# Altium schematic sheet carrier_card_s3.SchDoc: Debug LEDs / Anti-Aliasing / Motor Drivers
size A4; DrawnBy: Thomas Christensen; Revision: 2; SheetNumber: 3; SheetTotal: 3
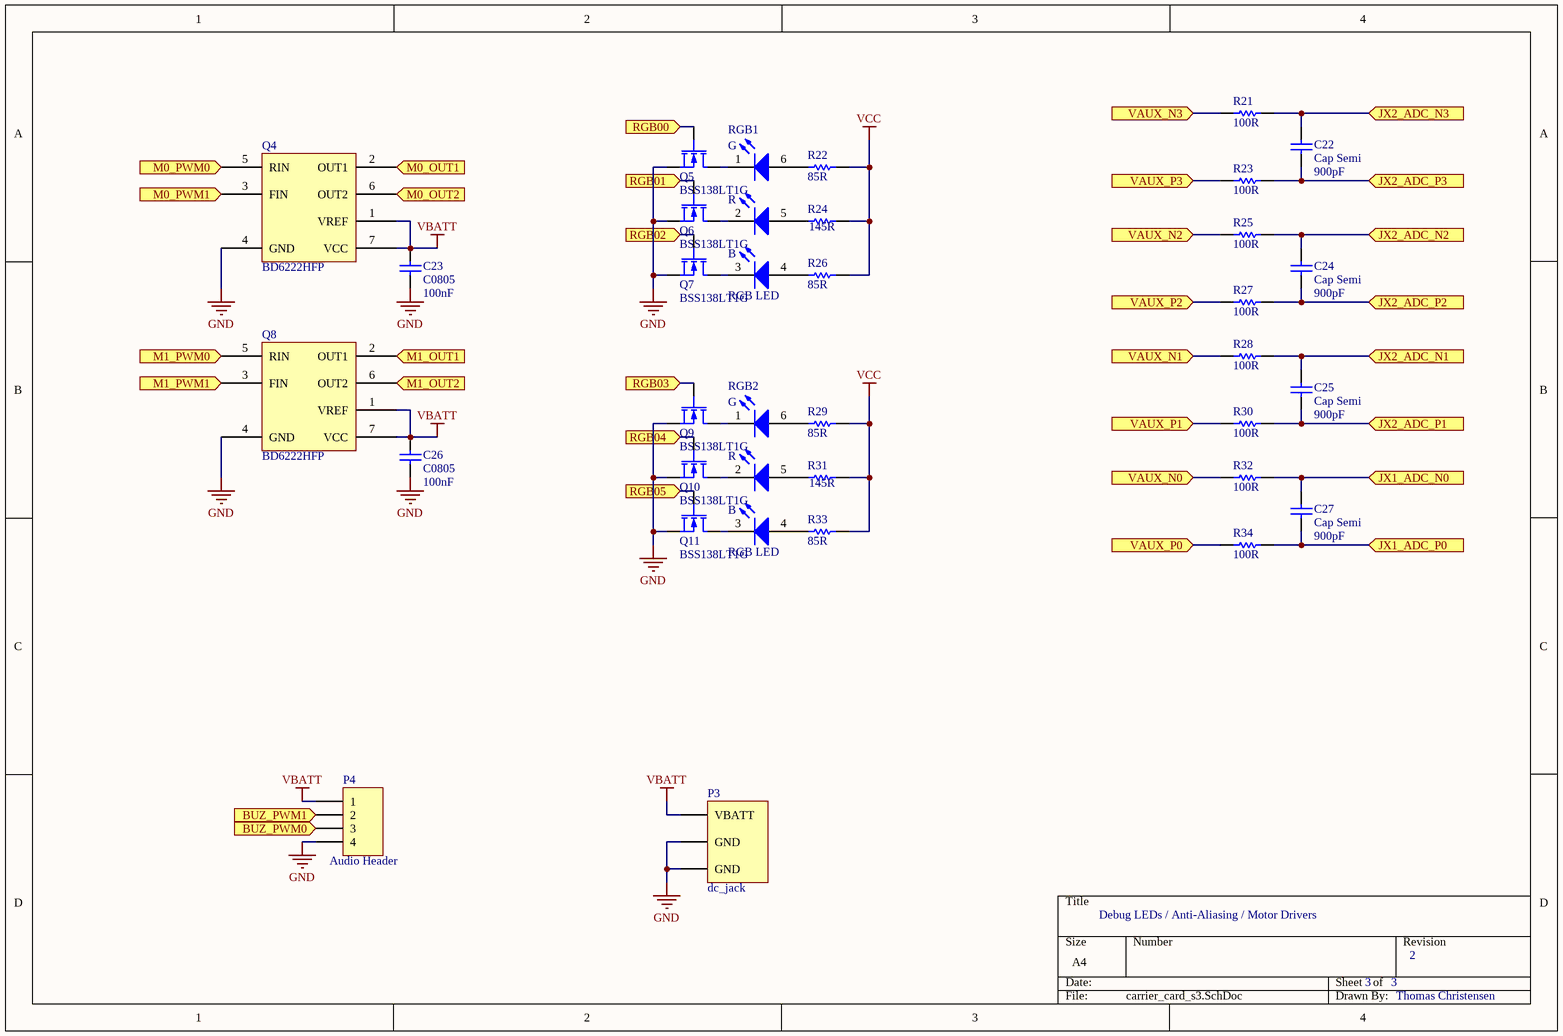
[diagram p0: carrier_card_s3.SchDoc]

## Parts
C22  Cap Semi  value 900pF  [0402]
C23  C0805  value 100nF  [0805]
C24  Cap Semi  value 900pF  [0402]
C25  Cap Semi  value 900pF  [0402]
C26  C0805  value 100nF  [0805]
C27  Cap Semi  value 900pF  [0402]
P3  dc_jack  [Power Jack]
P4  Audio Header  [HDR1X4]
Q4  BD6222HFP  [HRP7_N]
Q5  BSS138LT1G  [SOT-23B]
Q6  BSS138LT1G  [SOT-23B]
Q7  BSS138LT1G  [SOT-23B]
Q8  BD6222HFP  [HRP7_N]
Q9  BSS138LT1G  [SOT-23B]
Q10  BSS138LT1G  [SOT-23B]
Q11  BSS138LT1G  [SOT-23B]
R21  100R  [2-0402]
R22  85R  [ERA-0603]
R23  100R  [2-0402]
R24  145R  [ERA-0603]
R25  100R  [2-0402]
R26  85R  [ERA-0603]
R27  100R  [2-0402]
R28  100R  [2-0402]
R29  85R  [ERA-0603]
R30  100R  [2-0402]
R31  145R  [ERA-0603]
R32  100R  [2-0402]
R33  85R  [ERA-0603]
R34  100R  [2-0402]
RGB1  RGB LED  [RGB_LED]
RGB2  RGB LED  [RGB_LED]

## Ports
BUZ_PWM0, BUZ_PWM1, JX1_ADC_N0, JX1_ADC_P0, JX2_ADC_N1, JX2_ADC_N2, JX2_ADC_N3, JX2_ADC_P1, JX2_ADC_P2, JX2_ADC_P3, M0_OUT1, M0_OUT2, M0_PWM0, M0_PWM1, M1_OUT1, M1_OUT2, M1_PWM0, M1_PWM1, RGB00, RGB01, RGB02, RGB03, RGB04, RGB05, VAUX_N0, VAUX_N1, VAUX_N2, VAUX_N3, VAUX_P0, VAUX_P1, VAUX_P2, VAUX_P3

## Nets
GND: C23.1 C26.1 P3.2(GND) P3.3(GND) P4.4 Q4.4(GND) Q5.2(S) Q6.2(S) Q7.2(S) Q8.4(GND) Q9.2(S) Q10.2(S) Q11.2(S)
VBATT: C23.2 C26.2 P3.1(VBATT) P4.1 Q4.1(VREF) Q4.7(VCC) Q8.1(VREF) Q8.7(VCC)
VCC: R22.2 R24.2 R26.2 R29.2 R31.2 R33.2
BUZ_PWM0: P4.3 ; port BUZ_PWM0
BUZ_PWM1: P4.2 ; port BUZ_PWM1
JX1_ADC_N0: C27.2 R32.2 ; port JX1_ADC_N0
JX1_ADC_P0: C27.1 R34.2 ; port JX1_ADC_P0
JX2_ADC_N1: C25.2 R28.2 ; port JX2_ADC_N1
JX2_ADC_N2: C24.2 R25.2 ; port JX2_ADC_N2
JX2_ADC_N3: C22.2 R21.2 ; port JX2_ADC_N3
JX2_ADC_P1: C25.1 R30.2 ; port JX2_ADC_P1
JX2_ADC_P2: C24.1 R27.2 ; port JX2_ADC_P2
JX2_ADC_P3: C22.1 R23.2 ; port JX2_ADC_P3
M0_OUT1: Q4.2(OUT1) ; port M0_OUT1
M0_OUT2: Q4.6(OUT2) ; port M0_OUT2
M0_PWM0: Q4.5(RIN) ; port M0_PWM0
M0_PWM1: Q4.3(FIN) ; port M0_PWM1
M1_OUT1: Q8.2(OUT1) ; port M1_OUT1
M1_OUT2: Q8.6(OUT2) ; port M1_OUT2
M1_PWM0: Q8.5(RIN) ; port M1_PWM0
M1_PWM1: Q8.3(FIN) ; port M1_PWM1
RGB00: Q5.1(G) ; port RGB00
RGB01: Q6.1(G) ; port RGB01
RGB02: Q7.1(G) ; port RGB02
RGB03: Q9.1(G) ; port RGB03
RGB04: Q10.1(G) ; port RGB04
RGB05: Q11.1(G) ; port RGB05
VAUX_N0: R32.1 ; port VAUX_N0
VAUX_N1: R28.1 ; port VAUX_N1
VAUX_N2: R25.1 ; port VAUX_N2
VAUX_N3: R21.1 ; port VAUX_N3
VAUX_P0: R34.1 ; port VAUX_P0
VAUX_P1: R30.1 ; port VAUX_P1
VAUX_P2: R27.1 ; port VAUX_P2
VAUX_P3: R23.1 ; port VAUX_P3
NetQ5_3: Q5.3(D) RGB1.1
NetQ6_3: Q6.3(D) RGB1.2
NetQ7_3: Q7.3(D) RGB1.3
NetQ9_3: Q9.3(D) RGB2.1
NetQ10_3: Q10.3(D) RGB2.2
NetQ11_3: Q11.3(D) RGB2.3
NetR22_1: R22.1 RGB1.6
NetR24_1: R24.1 RGB1.5
NetR26_1: R26.1 RGB1.4
NetR29_1: R29.1 RGB2.6
NetR31_1: R31.1 RGB2.5
NetR33_1: R33.1 RGB2.4

## Notes on the sheet
- (in symbol LTRB R8SF) G; R; B

## Library data of the parts
C22 C24 C25 C27 = Cap Semi: Capacitor (Semiconductor SIM Model); Published: 8-Jun-2000; LatestRevisionDate: 29-May-2009; LatestRevisionNote: IPC-7351 Footprint Added.; PackageReference: C1206; Publisher: Altium Limited; PackageDescription: Chip Capacitor
C23 C26 = C0805: Ceramic Chip Capacitor - Standard; Note: Footprint corresponds to dimensions for bulk cassette packaging. This case size has tightened tolerances.; Published: 17-Jul-2002; LatestRevisionDate: 19-Mar-2004; LatestRevisionNote: Silkscreen size reduced.; DatasheetDocument: Mar-2001; PackageDocument: Mar-2001; PackageReference: 0805; Publisher: Altium Limited; Code_JEITA: 0805; Code_IPC: 2012[0805]; ComponentLink1Description: Manufacturer Link; ComponentLink1URL: http://www.kemet.com/; ComponentLink2Description: Datasheet; ComponentLink2URL: http://www.kemet.com/kemet/web/homepage/kechome.nsf/vapubfilesname/F3102TA.pdf/$file/F3102TA.pdf
P4 = Header 4: Header, 4-Pin; LatestRevisionDate: 17-Jul-2002; LatestRevisionNote: Re-released for DXP Platform.; Publisher: Altium Limited
Q5-Q7 Q9-Q11 = BSS138LT1G: N-Channel MOSFET; Published: 8-Jun-2000; LatestRevisionDate: 17-Jul-2002; LatestRevisionNote: Re-released for DXP Platform.; PackageVersion: 1995/1996; PackageReference: E3; Publisher: Altium Limited; PackageDescription: TO, Flat Index; 3 In-Line, Axial Leads; Body Dia. 4.6mm; Lead Dia. 0.5 mm (max)
R21 R23 R25 R27 R28 R30 R32 R34 = ERJ2GE: Thick Film Chip Resistor, 1 Ohm to 2.2M Ohm Range, 5% Tolerance, 0402 Size, 0.063 W; Note: If flow soldering, adjust pad width of PCB Footprint to 0.7 - 0.8 times the width of the resistor.; Published: 17-Dec-2003; LatestRevisionDate: 19-Mar-2004; LatestRevisionNote: Silkscreen size reduced.; PackageDocument: Mar-2003; PackageReference: 2-0402; Publisher: Altium Limited; Code_IPC: 1005 [0402]; ComponentLink1Description: Manufacturer Link; ComponentLink1URL: http://www.panasonic.com/industrial/components/resistive_products.htm; ComponentLink2Description: Datasheet; ComponentLink2URL: http://www.panasonic.com/industrial/components/pdf/AOA0000CE1.pdf
R22 R24 R26 R29 R31 R33 = ERA3Y: Rectangular Thick Film Chip Resistor, 10 Ohm to 330k Ohm Range, 0.1% and 0.5% Tolerance, 0603 Size, 0.063 W; Note: If flow soldering, adjust pad width of PCB Footprint to 0.7 - 0.8 times the width of the resistor.; Published: 17-Dec-2003; LatestRevisionDate: 19-Mar-2004; LatestRevisionNote: Silkscreen size reduced.; PackageDocument: Mar-2003; PackageReference: ERA-0603; Publisher: Altium Limited; Code_IPC: 1608 [0603]; ComponentLink1Description: Manufacturer Link; ComponentLink1URL: http://www.panasonic.com/industrial/components/resistive_products.htm; ComponentLink2Description: Datasheet; ComponentLink2URL: http://www.panasonic.com/industrial/components/pdf/AOA0000CE8.pdf
RGB1 RGB2 = LTRB R8SF